# EAGLE design diode rectifier (EAGLE 9.0.0)
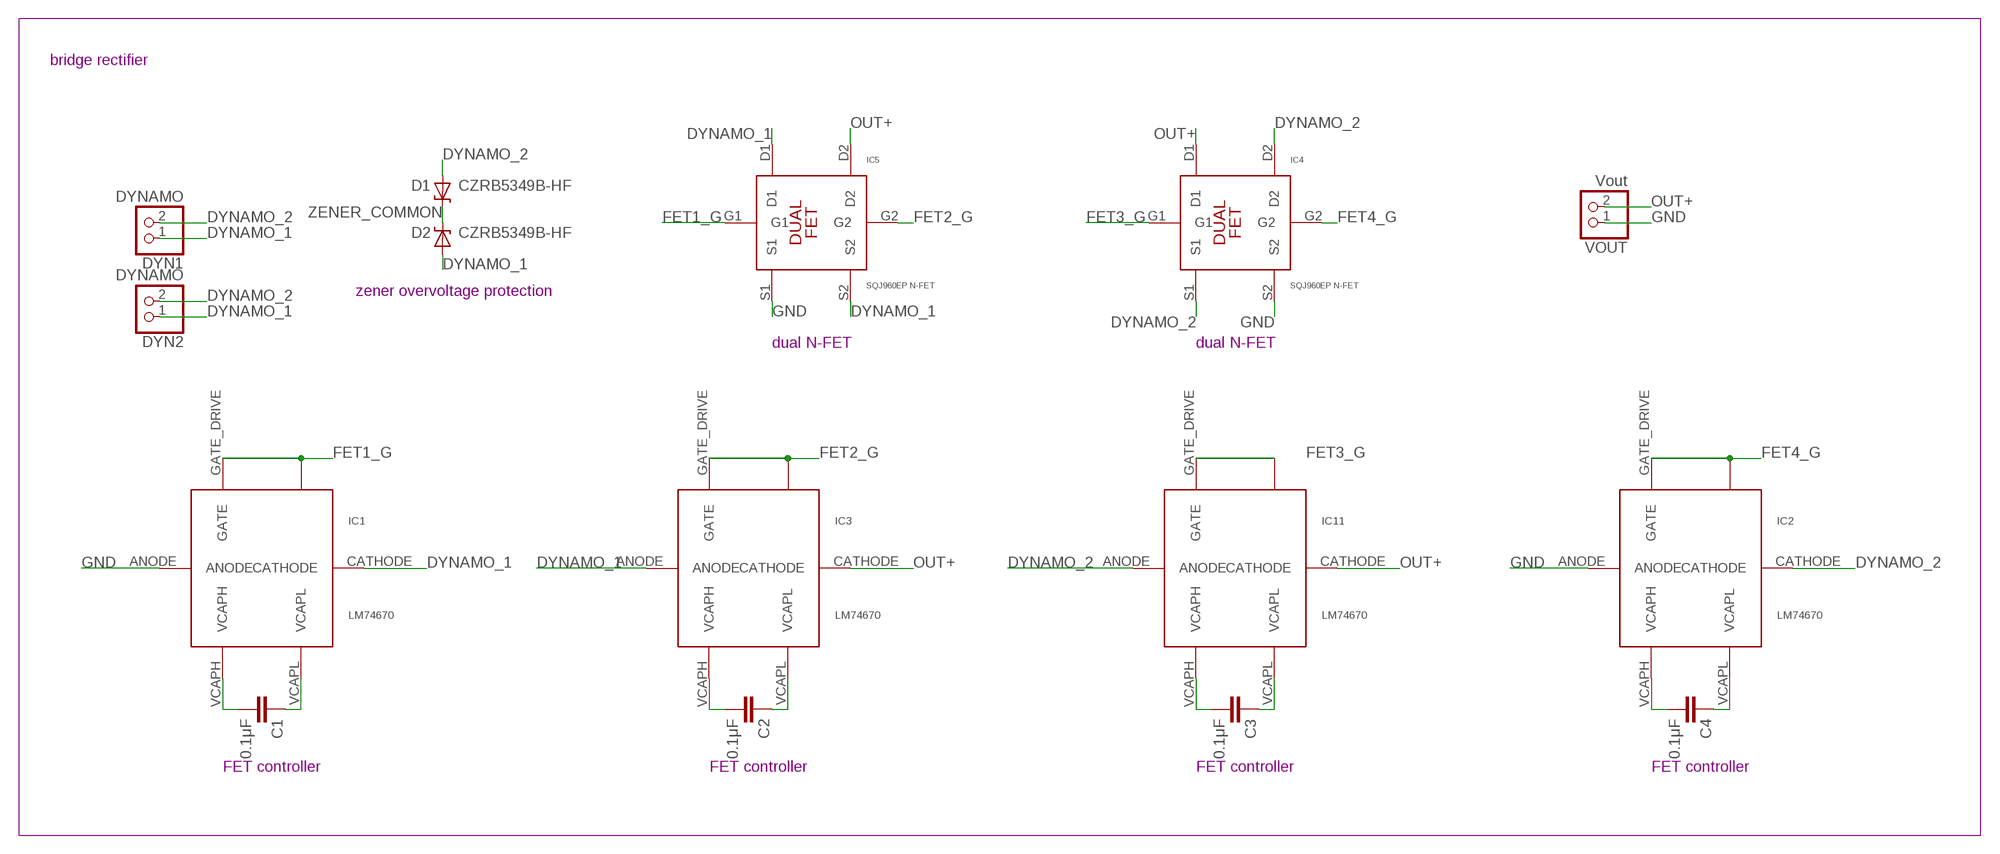
[diagram p0: schematic, sheet 1]

## Parts
C1  0.1μF  C-EUC0805  [C0805]
C2  0.1μF  C-EUC0805  [C0805]
C3  0.1μF  C-EUC0805  [C0805]
C4  0.1μF  C-EUC0805  [C0805]
D1  CZRB5349B-HF  ZENER  [DO-214]
D2  CZRB5349B-HF  ZENER  [DO-214]
DYN1  DYNAMO  PINHD-1X2  [1X02]
DYN2  DYNAMO  PINHD-1X2  [1X02]
IC1  LM74670  [VSSOP-8]
IC2  LM74670  [VSSOP-8]
IC3  LM74670  [VSSOP-8]
IC4  SQJ960EP N-FET  SQJ96XEP  [SO-8L]
IC5  SQJ960EP N-FET  SQJ96XEP  [SO-8L]
IC11  LM74670  [VSSOP-8]
VOUT  Vout  PINHD-1X2  [1X02]

## Nets
DYNAMO_1: D2.AN DYN1.1 DYN2.1 IC1.CATHODE IC3.ANODE IC5.D1 IC5.S2
DYNAMO_2: D1.AN DYN1.2 DYN2.2 IC2.CATHODE IC4.D2 IC4.S1 IC11.ANODE
FET1_G: IC1.GATE_DRIVE(GATE) IC1.GATE_PULLD IC5.G1
FET2_G: IC3.GATE_DRIVE(GATE) IC3.GATE_PULLD IC5.G2
FET3_G: IC4.G1 IC11.GATE_DRIVE(GATE) IC11.GATE_PULLD
FET4_G: IC2.GATE_DRIVE(GATE) IC2.GATE_PULLD IC4.G2
GND: IC1.ANODE IC2.ANODE IC4.S2 IC5.S1 VOUT.1
N$1: C1.2 IC1.VCAPH
N$2: C1.1 IC1.VCAPL
N$3: C2.2 IC3.VCAPH
N$4: C2.1 IC3.VCAPL
N$5: C3.2 IC11.VCAPH
N$6: C3.1 IC11.VCAPL
N$7: C4.2 IC2.VCAPH
N$8: C4.1 IC2.VCAPL
OUT+: IC3.CATHODE IC4.D1 IC5.D2 IC11.CATHODE VOUT.2
ZENER_COMMON: D1.CAT D2.CAT

## Notes on the sheet
- bridge rectifier
- zener overvoltage protection
- dual N-FET | dual N-FET
- FET controller | FET controller | FET controller | FET controller

## Library data of the parts
C1-C4 = rcl:C-EU: CAPACITOR, European symbol; SPICEPREFIX: C
D1 D2 = zener:ZENER: Zener diode
DYN1 DYN2 VOUT = pinhead:PINHD-1X2: PIN HEADER
IC1-IC3 IC11 = LM74670 - Smart Diode Rectifier Controller:LM74670
IC4 IC5 = SQJ96XEP - MosFET:SQJ96XEP

## Net classes
0 GND: width 0.4 mm, drill 0.4 mm, clearance 0.1 mm

## Board
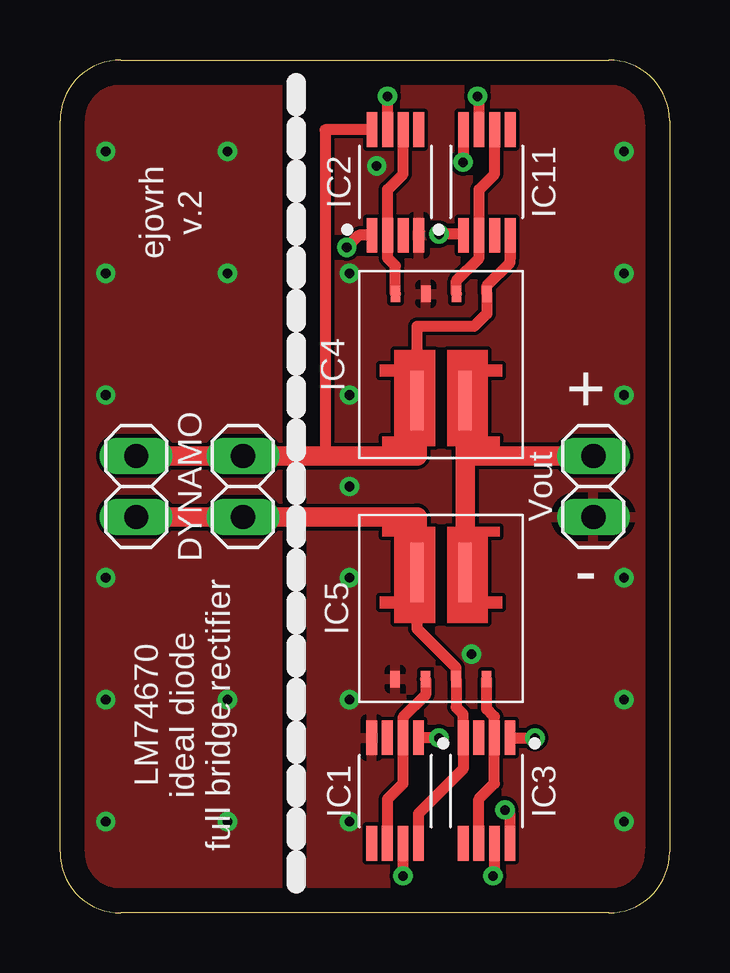
[diagram p1: board, top side]
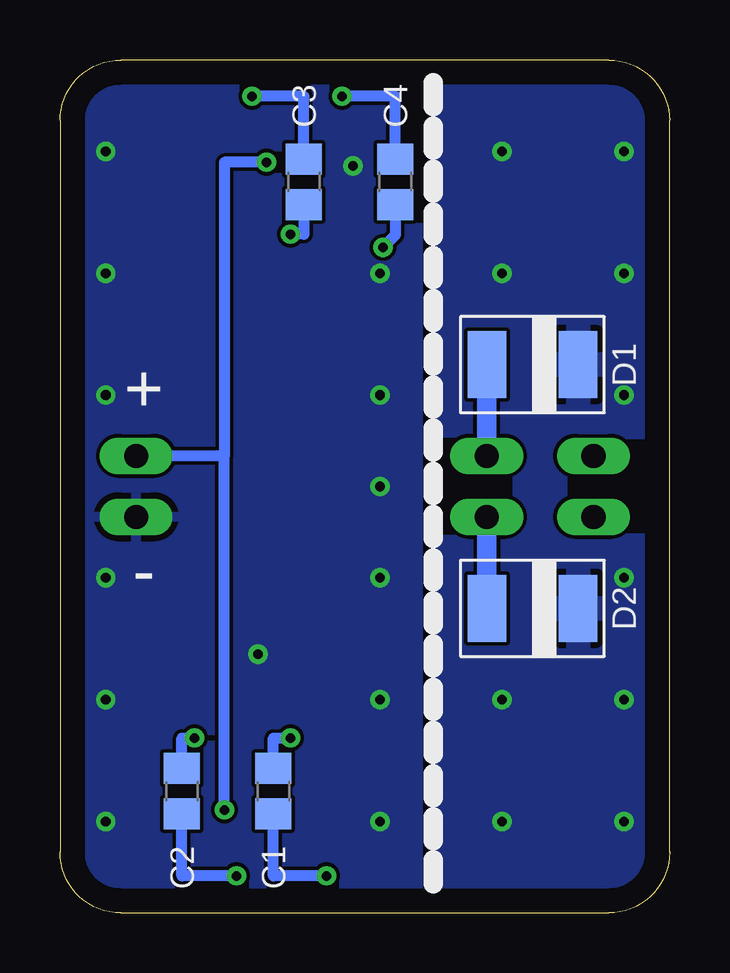
[diagram p2: board, bottom side, seen from below]

Size 25.4 x 35.56 mm. Coordinates in mm from the lower left corner, seen from the top.
Outline: 2.54,35.56 22.86,35.56 arc-90 25.4,33.02 25.4,2.54 arc-90 22.86,0 2.54,0 arc-90 0,2.54 0,33.02 arc-90 2.54,35.56
Copper layers (1*16): Top 0.035mm / dielectric 1.5mm / Bottom 0.035mm
Design rules "default": minimum track width 6mil, minimum drill 0.35mm, track to track 6mil, track to pad 6mil, pad to pad 6mil, via to via 6mil, smd to smd 6mil, copper to edge 40mil, drill to drill 6mil, minimum pad ring 10mil, minimum via ring 8mil, stop-mask expansion 4mil, vias tented up to drill 0mil, thermal gap 10mil

### Footprints (pad centres in the part's own frame; a part is rotated, then mirrored left to right if it is on the bottom)
C0805 = smd 1.3 x 1.5: 1 -0.95,0; 2 0.95,0
DO-214 = smd 1.6 x 2.8: AN 1.9,0; CAT -1.9,0
1X02 = drill 1.016 long: 1 -1.27,0; 2 1.27,0
VSSOP-8 = smd 0.45 x 1.45: ANODE 0.98,-2.23; CATHODE -0.97,2.17; GATE_DRIVE 0.33,2.17; GATE_PULLD -0.32,-2.23; NC1 0.33,-2.23; NC2 0.98,2.17; VCAPH -0.32,2.17; VCAPL -0.97,-2.23
SO-8L = smd 0.58 x 2.5: D1 -1,1.5; D2 1,1.5 | smd 0.4 x 0.7: G1 -0.64,-2.95; G2 1.9,-2.95; S1 -1.91,-2.95; S2 0.63,-2.95

### Placement (x,y rotation side)
C1  16.51,5.08 270 bottom
C2  20.32,5.08 270 bottom
C3  15.24,30.48 90 bottom
C4  11.43,30.48 90 bottom
D1  5.72,22.86 180 bottom
D2  5.72,12.7 180 bottom
DYN1  3.18,17.78 90 top
DYN2  7.62,17.78 90 top
IC1  13.97,5.08 180 top
IC2  13.97,30.48 0 top
IC3  17.78,5.08 180 top
IC4  15.88,22.86 180 top
IC5  15.88,12.7 0 top
IC11  17.78,30.48 0 top
VOUT  22.22,17.78 90 top

### Tracks (layer width: path | path; a pad name or v marks a point on that pad's centre or on a via)
DYNAMO_1
  Top 0.406: 16.82,7.29 IC3.ANODE
  Top 0.45: IC1.CATHODE 14.94,4.15 16.8,6 IC3.ANODE 16.8,8.28 16.5,8.58 IC5.S2 16.5,10.22 14.88,11.85 IC5.D1
  Top 0.813: DYN1.1 DYN2.1 14.88,16.51 IC5.D1
  Bottom 0.813: DYN2.1 D2.AN
DYNAMO_2
  Top 0.45: IC4.D2 14.88,24.45 17.25,24.45 17.79,24.99 IC4.S1 17.79,26.15 18.76,27.12 IC11.ANODE 18.76,27.26 | IC2.CATHODE 11.05,32.65 11.05,19.05
  Top 0.813: DYN1.2 DYN2.2 11.05,19.05 14.88,19.05 IC4.D2
  Bottom 0.813: DYN2.2 D1.AN
FET1_G
  Top 0.45: IC5.G1 15.24,9.09 14.29,8.14 IC1.GATE_PULLD 14.29,5.39 14.05,5.15 13.85,4.95 13.64,4.74 IC1.GATE_DRIVE
FET2_G
  Top 0.45: IC5.G2 17.77,8.51 18.1,8.18 IC3.GATE_PULLD 18.1,5.4 17.45,4.75 IC3.GATE_DRIVE
FET3_G
  Top 0.406: IC11.GATE_PULLD
  Top 0.45: IC4.G1 16.52,26.36 17.46,27.31 IC11.GATE_PULLD | IC11.GATE_PULLD 17.46,30.16 18.11,30.81 IC11.GATE_DRIVE
FET4_G
  Top 0.45: IC4.G2 13.98,26.98 13.65,27.31 IC2.GATE_PULLD 13.65,30.16 14.3,30.81 IC2.GATE_DRIVE
GND  (via drill 0.4)
  other vias: 23.5,31.75 12.06,8.89 12.06,3.81 12.06,21.59 12.06,26.67 23.5,26.67 23.5,8.89 23.5,21.59 23.5,13.97 23.5,3.81 12.06,13.97 12.06,17.78 13.2,31.15 17.14,10.79
  pour Top: 10.48,35.88 10.48,-0.95 25.72,-0.95 25.72,35.88
  pour Bottom: 10.48,35.88 25.72,35.88 25.72,-0.95 10.48,-0.95
N$1  (via drill 0.4)
  Top 0.45: IC1.VCAPH v14.29,1.55 v14.3,1.55
  Bottom 0.45: v14.3,1.55 16.51,1.55 C1.2
N$2  (via drill 0.4)
  Top 0.45: v15.8,7.3 15.79,7.31 IC1.VCAPL
  Bottom 0.45: C1.1 16.51,7.3 v15.8,7.3
N$3  (via drill 0.4)
  Top 0.45: IC3.VCAPH 18.1,1.6 v18.05,1.55
  Bottom 0.45: v18.05,1.55 20.32,1.55 C2.2
N$4  (via drill 0.4)
  Top 0.45: IC3.VCAPL 18.76,7.3 v19.8,7.3
  Bottom 0.45: C2.1 20.32,7.3 v19.8,7.3
N$5  (via drill 0.4)
  Top 0.45: IC11.VCAPH 17.46,34.05 v17.4,34.05
  Bottom 0.45: C3.2 15.24,34.05 v17.4,34.05
N$6  (via drill 0.4)
  Top 0.45: IC11.VCAPL 16.76,28.3 v15.8,28.3
  Bottom 0.45: C3.1 15.24,28.3 v15.8,28.3
N$7  (via drill 0.4)
  Top 0.45: IC2.VCAPH v13.65,34.05
  Bottom 0.45: C4.2 11.43,34.05 v13.65,34.05
N$8  (via drill 0.4)
  Top 0.45: IC2.VCAPL 12.45,28.25 v11.95,27.75
  Bottom 0.45: C4.1 11.43,28.27 v11.95,27.75
OUT+  (via drill 0.4)
  Top 0.45: IC11.CATHODE 16.81,31.31 v16.8,31.3 | IC3.CATHODE 18.75,4.1 v18.55,4.3
  Top 0.813: 16.88,19.05 IC5.D2 | VOUT.2 16.88,19.05 | 16.88,19.05 IC4.D1
  Bottom 0.45: 18.55,19.05 VOUT.2 | v18.55,4.3 18.55,19.05 | v16.8,31.3 18.55,31.3 18.55,19.05
ZENER_COMMON  (via drill 0.4)
  other vias: 6.99,31.75 1.9,31.75 1.9,26.67 6.99,8.89 6.99,26.67 1.9,8.89 6.99,3.81 1.9,3.81 1.9,21.59 1.9,13.97
  pour Bottom: 9.21,35.88 -0.95,35.88 -0.95,-0.95 9.21,-0.95
  pour Top: -0.95,35.88 9.21,35.88 9.21,-0.95 -0.95,-0.95

### Text on the board
tPlace: + | -
bPlace: + | -
tNames: ejovrh | v.2 | DYNAMO | Vout | LM74670 / ideal diode / full bridge rectifier